# EAGLE design Grove - Tricks v1.0 (EAGLE 7.1.0)

## Sheet 1 of 6
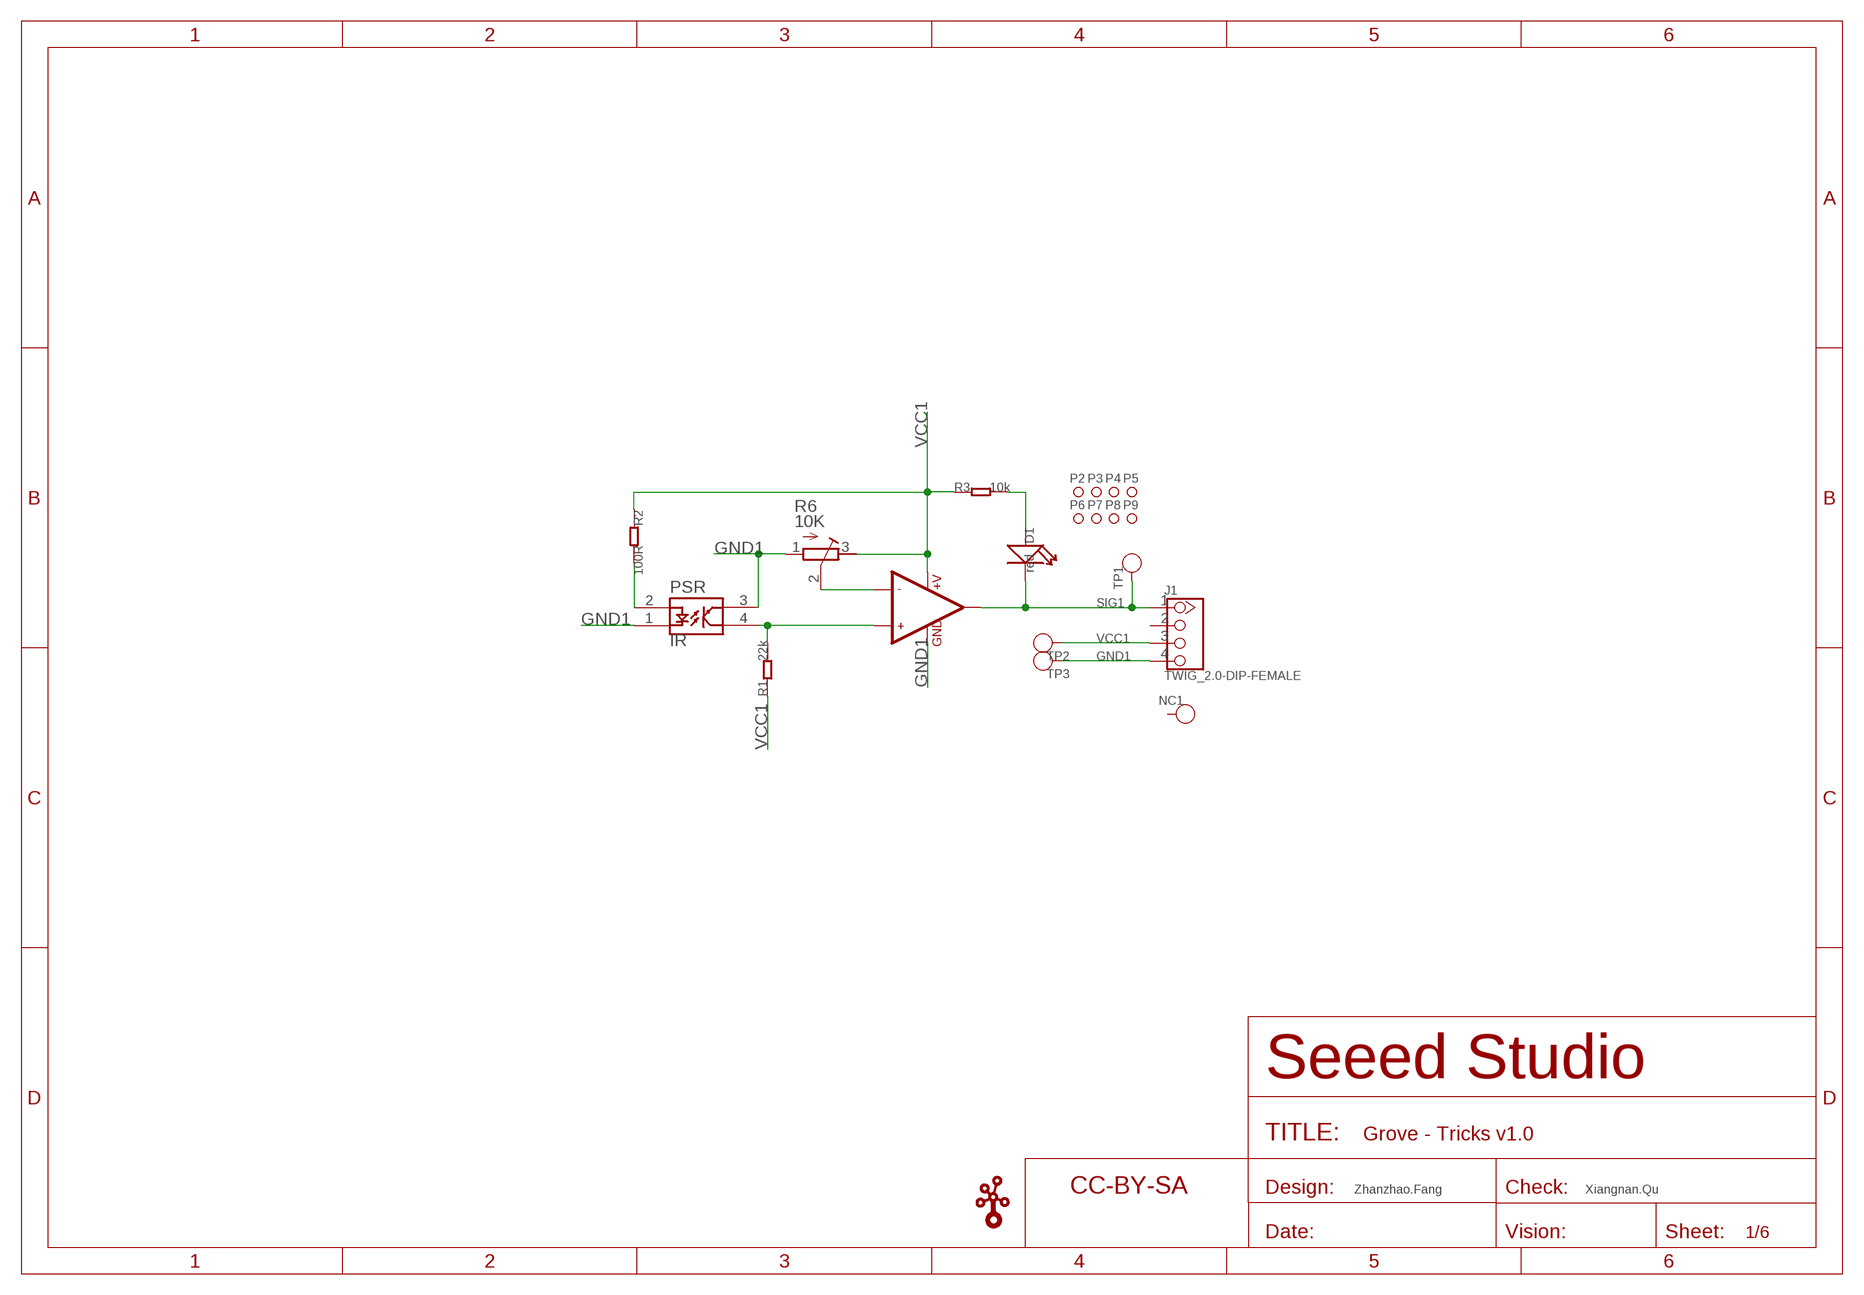
[diagram p0: schematic, sheet 1]

### Parts
D1  red  007-LED35*40  [LED0603]
J1  TWIG_2.0-DIP-FEMALE  [2.0_1X4]
NC1  TEST-POINT'4545'  [TP-D45MIL]
P2  MARK-1.0'ANNULAR'  [ROUND-MARK-1.0]
P3  MARK-1.0'ANNULAR'  [ROUND-MARK-1.0]
P4  MARK-1.0'ANNULAR'  [ROUND-MARK-1.0]
P5  MARK-1.0'ANNULAR'  [ROUND-MARK-1.0]
P6  MARK-1.0'ANNULAR'  [ROUND-MARK-1.0]
P7  MARK-1.0'ANNULAR'  [ROUND-MARK-1.0]
P8  MARK-1.0'ANNULAR'  [ROUND-MARK-1.0]
P9  MARK-1.0'ANNULAR'  [ROUND-MARK-1.0]
PSR  PSR  [PSR]
R1  22k  005-R0603_S  [0603_S]
R2  100R  005-R0603_S  [0603_S]
R3  10k  005-R0603_S  [0603_S]
R6  10K  R-TRIMM3214W  [RTRIM3214W]
TP1  TEST-POINT'4545'  [TP-D45MIL]
TP2  TEST-POINT'4545'  [TP-D45MIL]
TP3  TEST-POINT'4545'  [TP-D45MIL]
U1  002-LMV358  [SO08]
U$2  TWIGLOGOTWIGLOGO_SMALL  [TWIGLOGO_SMALL]
U$3  SEEEDSTUDIO-OPEN-SCH-FRAME  [SEEEDSTUDIO-PCB-FRAME]

### Nets
GND1: J1.4 PSR.1 PSR.3 R6.1(E) TP3.T U1.4(GND)
N$1: R6.2(S) U1.2(-IN1)
N$2: PSR.4 R1.2 U1.3(+IN1)
N$5: PSR.2 R2.2
N$12: D1.1(+) R3.2
SIG1: D1.2(-) J1.1 TP1.T U1.1(OUT1)
VCC1: J1.3 R1.1 R2.1 R3.1 R6.3(A) TP2.T U1.8(+V)
Unconnected: J1.2 NC1.T U1.5(+IN2) U1.6(-IN2) U1.7(OUT2)

### Notes on the sheet
- Zhanzhao.Fang | Xiangnan.Qu

## Sheet 2 of 6
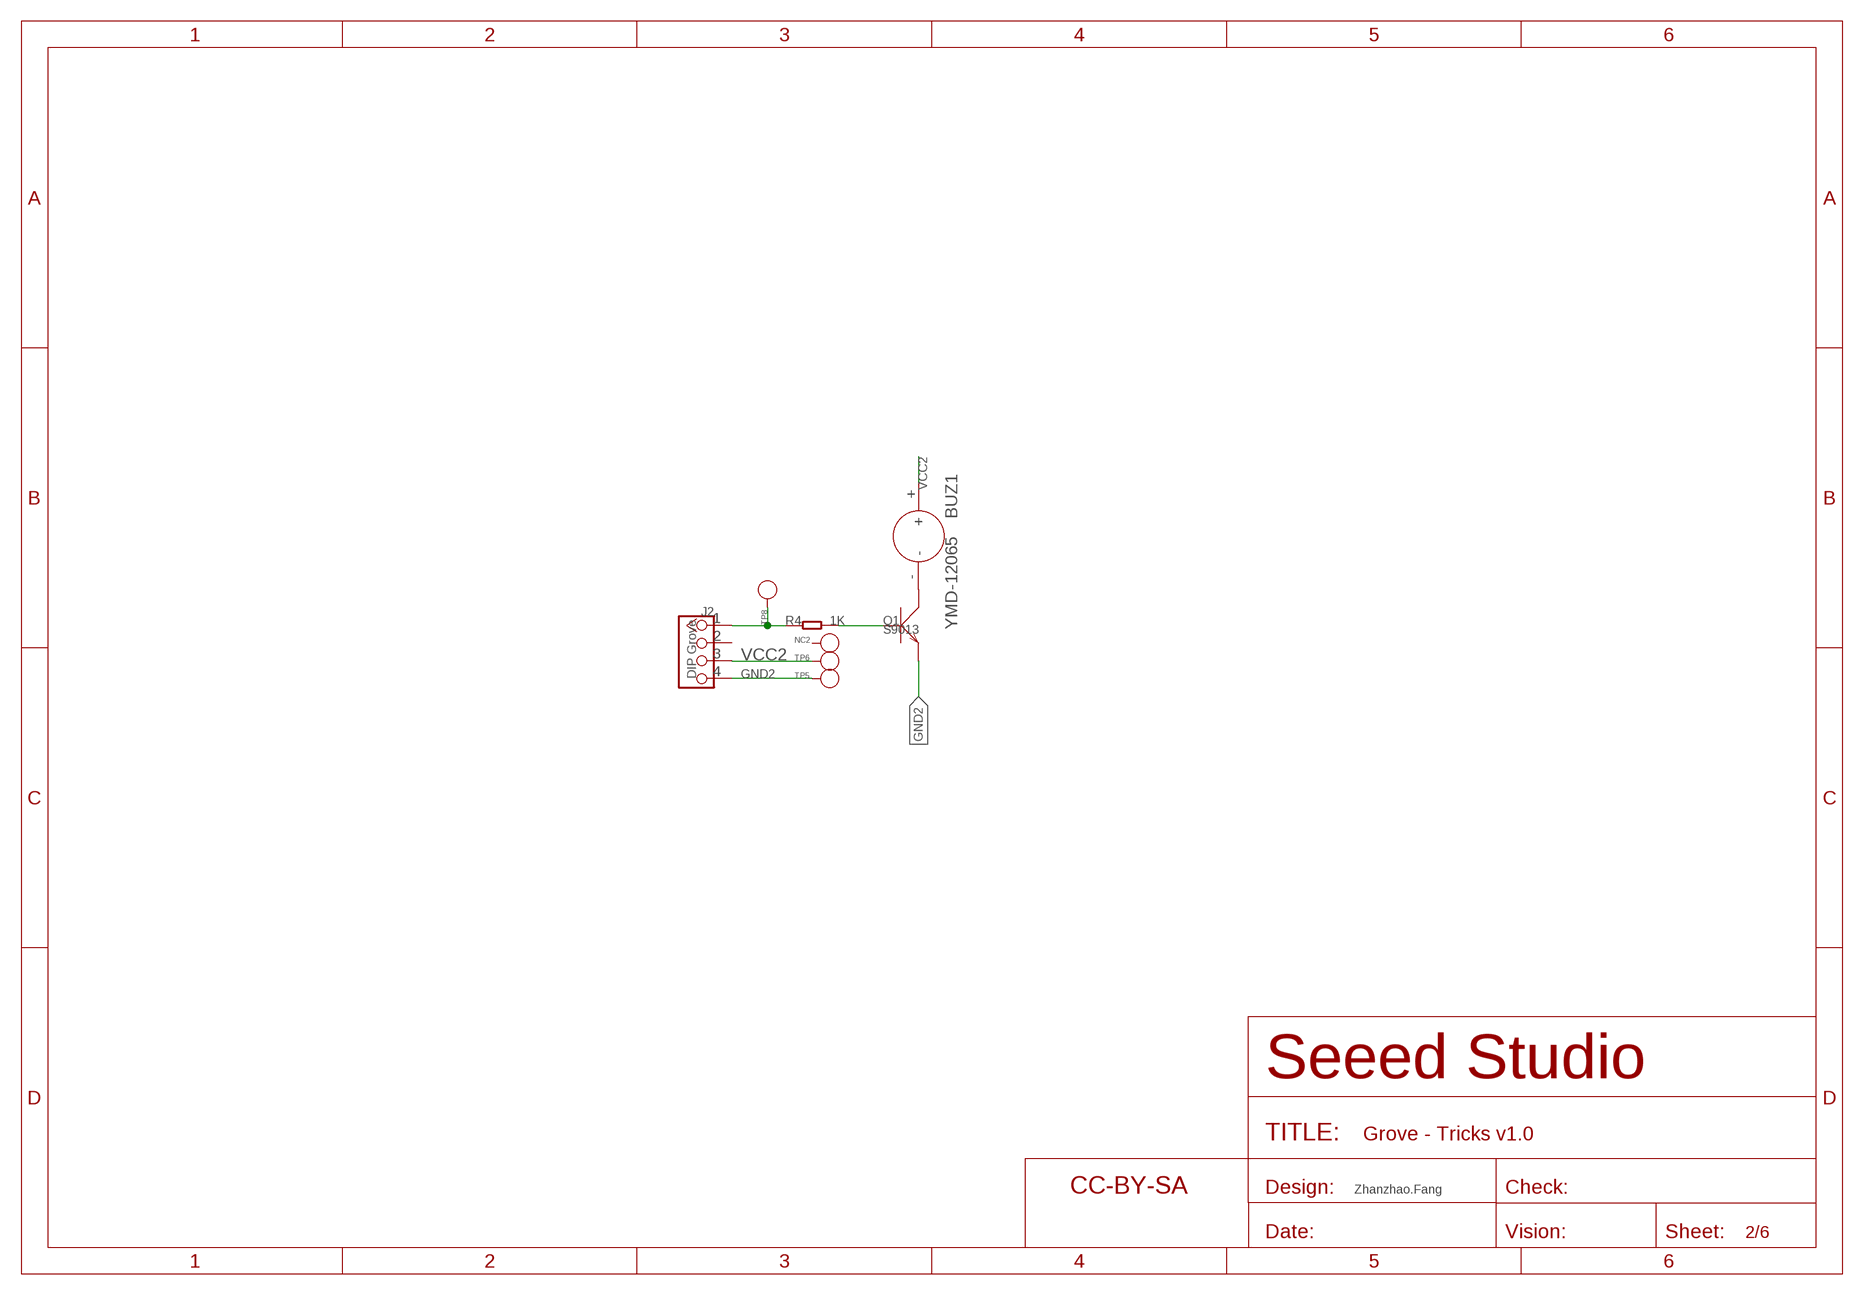
[diagram p1: schematic, sheet 2]

### Parts
BUZ1  YMD-12065  BUZZER-YMD12065  [2P-7.6-D12X6.5H]
J2  DIP Grove  TWIG-4P-2.0-2.0  [4P-2.0]
NC2  PAD-TEST-POINT'4545'  [TP_4545]
Q1  S9013  TRANSISTOR-NPN-SOT23  [SOT23]
R4  1K  R-0603  [R0603]
TP5  PAD-TEST-POINT'4545'  [TP_4545]
TP6  PAD-TEST-POINT'4545'  [TP_4545]
TP8  PAD-TEST-POINT'4545'  [TP_4545]
U$6  SEEEDSTUDIO-OPEN-SCH-FRAME  [SEEEDSTUDIO-PCB-FRAME]

### Nets
GND2: J2.4 Q1.2(E) TP5.T
N$3: Q1.1(B) R4.2
N$4: BUZ1.- Q1.3(C)
N$10: J2.1 R4.1 TP8.T
VCC2: BUZ1.+ J2.3 TP6.T
Unconnected: J2.2 NC2.T

### Notes on the sheet
- Zhanzhao.Fang

## Sheet 3 of 6
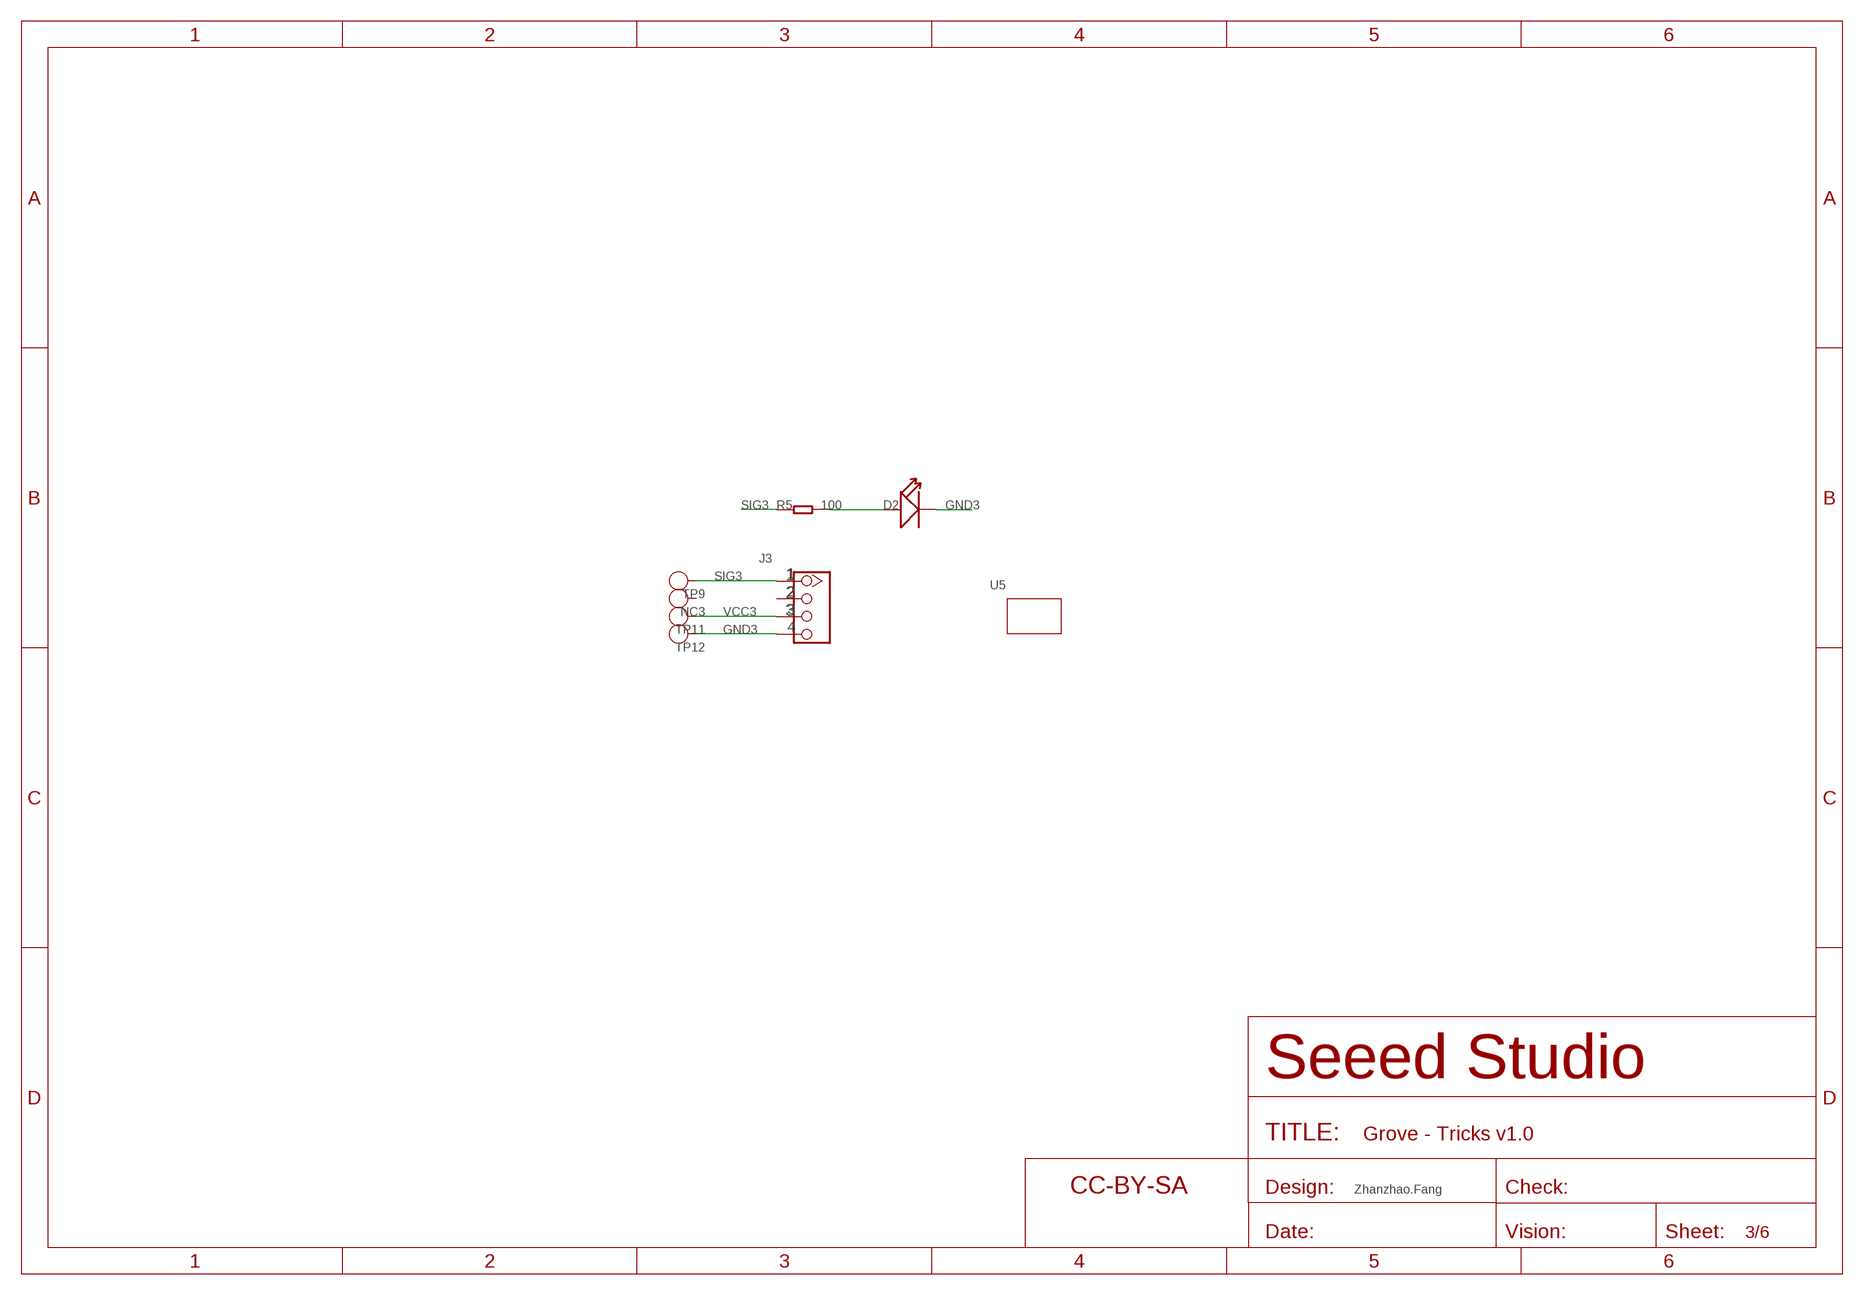
[diagram p2: schematic, sheet 3]

### Parts
D2  LED-3MM  [LED-2P-2.54-3MM]
J3  GROVE-CONNECTOR-DIP-2.0  [HW4-2.0]
NC3  TEST-POINT'4545'  [TP-D45MIL]
R5  100  R-1206  [R1206]
TP9  TEST-POINT'4545'  [TP-D45MIL]
TP11  TEST-POINT'4545'  [TP-D45MIL]
TP12  TEST-POINT'4545'  [TP-D45MIL]
U5  GROVE  [GROVE-1*1-TEST-PLATFORM-LED]
U$4  SEEEDSTUDIO-OPEN-SCH-FRAME  [SEEEDSTUDIO-PCB-FRAME]

### Nets
GND3: D2.K(-) J3.4 TP12.T
N$6: D2.A(+) R5.2
SIG3: J3.1 R5.1 TP9.T
VCC3: J3.3 TP11.T
Unconnected: J3.2 NC3.T

### Notes on the sheet
- 1
- 2
- 3
- Zhanzhao.Fang

## Sheet 4 of 6
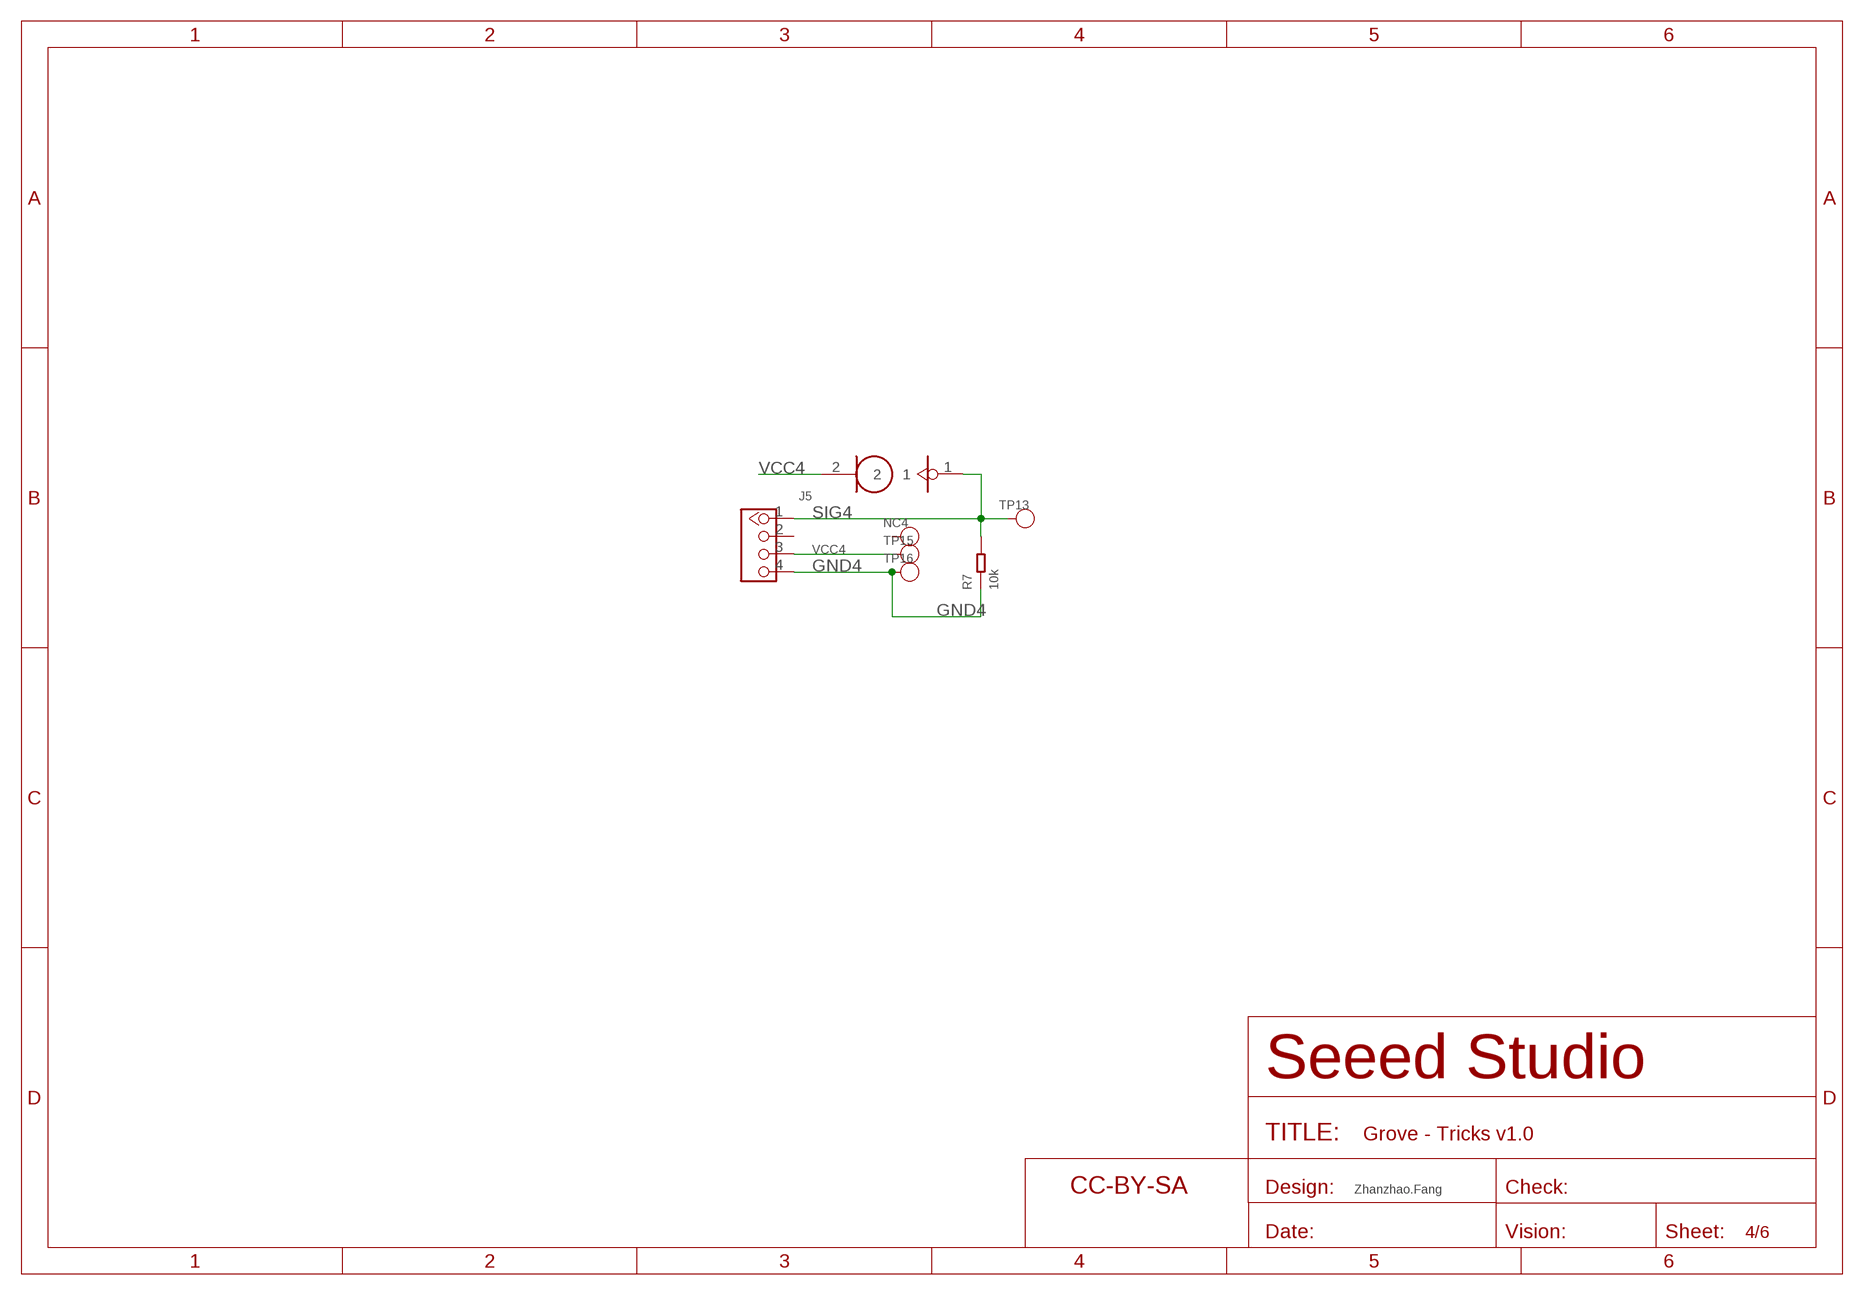
[diagram p3: schematic, sheet 4]

### Parts
J4  TILT  [TILT]
J5  GROVE-CONNECTOR-DIP-2.0  [HW4-2.0]
NC4  TEST-POINT'4545'  [TP-D45MIL]
R7  10k  RES-0603  [R0603]
TP13  TEST-POINT'4545'  [TP-D45MIL]
TP15  TEST-POINT'4545'  [TP-D45MIL]
TP16  TEST-POINT'4545'  [TP-D45MIL]
U$5  SEEEDSTUDIO-OPEN-SCH-FRAME  [SEEEDSTUDIO-PCB-FRAME]

### Nets
GND4: J5.4 R7.1 TP16.T
SIG4: J4.1 J5.1 R7.2 TP13.T
VCC4: J4.2 J5.3 TP15.T
Unconnected: J5.2 NC4.T

### Notes on the sheet
- Zhanzhao.Fang

## Sheet 5 of 6
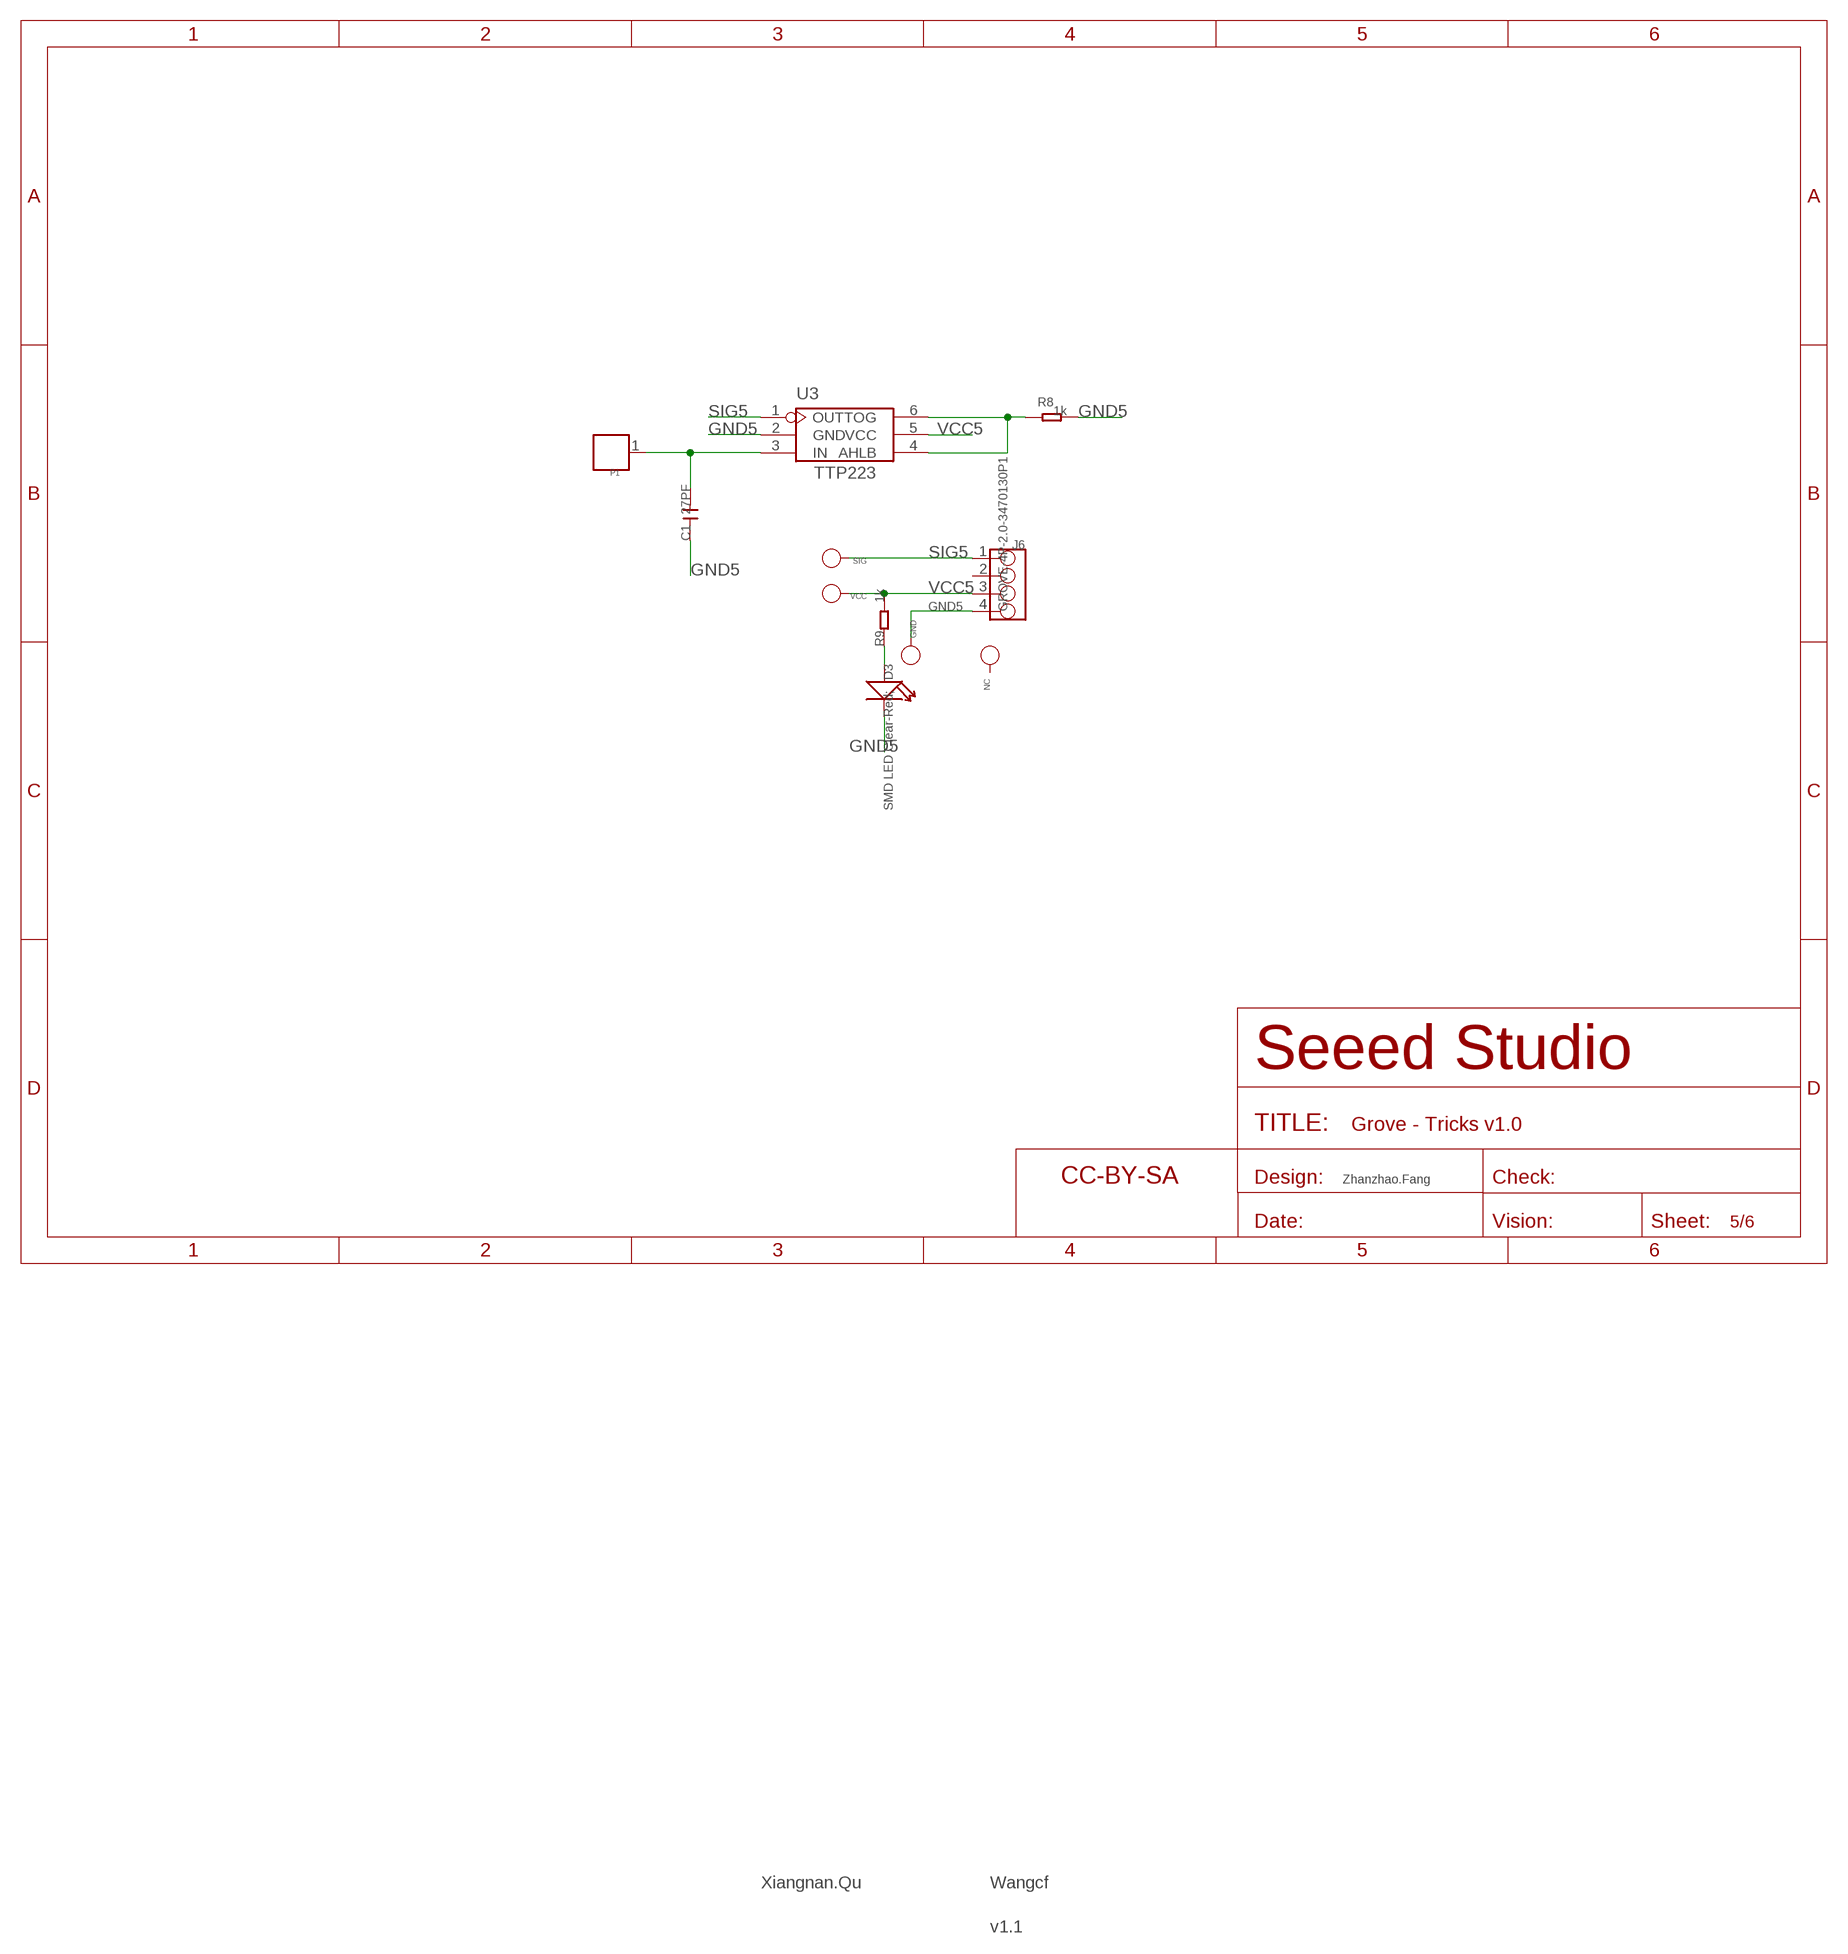
[diagram p4: schematic, sheet 5]

### Parts
C1  27PF  C-0603  [C0603]
D3  SMD LED Clear-Red;  LED'0603'  [LED-0603]
GND  PAD-TEST-POINT'4545'  [TP_4545]
J6  GROVE-4P-2.0-3470130P1  [4P-2.0]
NC  PAD-TEST-POINT'4545'  [TP_4545]
P1  PAD'D450MIL'  [1P-D450]
R8  1k  R-0603  [R0603]
R9  1k  R-0603  [R0603]
SIG  PAD-TEST-POINT'4545'  [TP_4545]
U3  TTP223  [SOT23-6L]
U$12  SEEEDSTUDIO-OPEN-SCH-FRAME  [SEEEDSTUDIO-PCB-FRAME]
VCC  PAD-TEST-POINT'4545'  [TP_4545]

### Nets
GND5: C1.1 D3.- GND.T J6.4 R8.2 U3.2(GND)
IN: C1.2 P1.1 U3.3(IN)
N$7: R8.1 U3.4(AHLB) U3.6(TOG)
N$8: D3.+ R9.1
SIG5: J6.1 SIG.T U3.1(OUT)
VCC5: J6.3 R9.2 U3.5(VCC) VCC.T
Unconnected: J6.2 NC.T

### Notes on the sheet
- TTP223
- Zhanzhao.Fang
- Xiangnan.Qu | Wangcf
- v1.1

## Sheet 6 of 6
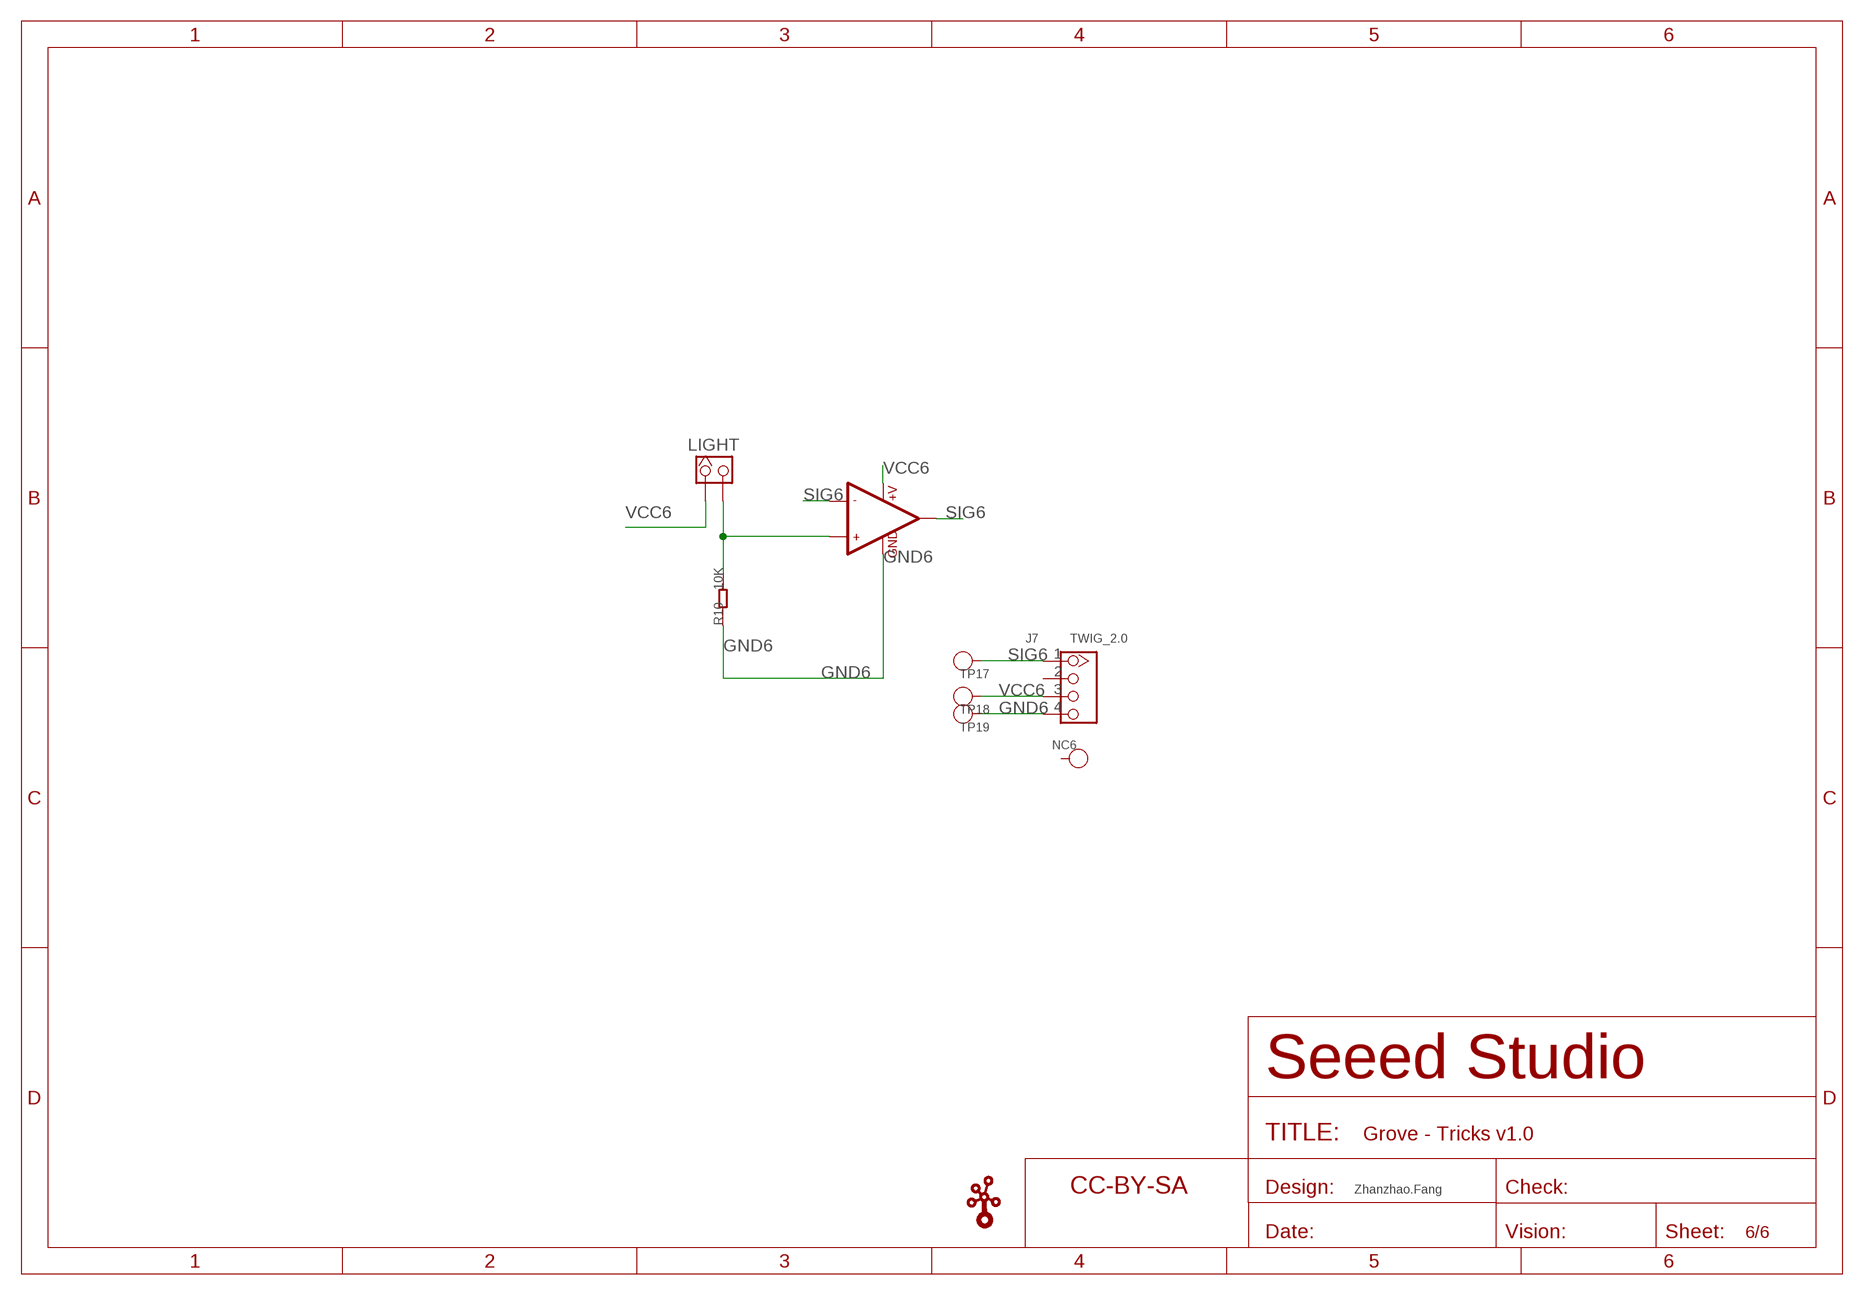
[diagram p5: schematic, sheet 6]

### Parts
J7  TWIG_2.0  GROVE-CONNECTOR-DIP-2.0  [HW4-2.0]
LIGHT  HEADER_1X2_2.54  [CK_1*2]
NC6  TEST-POINT'4545'  [TP-D45MIL]
R10  10K  R0603  [0603]
TP17  TEST-POINT'4545'  [TP-D45MIL]
TP18  TEST-POINT'4545'  [TP-D45MIL]
TP19  TEST-POINT'4545'  [TP-D45MIL]
U4  LMV358  [SO08]
U$13  SEEEDSTUDIO-OPEN-SCH-FRAME  [SEEEDSTUDIO-PCB-FRAME]
U$16  TWIGLOGOTWIGLOGO_SMALL  [TWIGLOGO_SMALL]

### Nets
GND6: J7.4 R10.1 TP19.T U4.4(GND)
N$9: LIGHT.2 R10.2 U4.3(+IN1)
SIG6: J7.1 TP17.T U4.1(OUT1) U4.2(-IN1)
VCC6: J7.3 LIGHT.1 TP18.T U4.8(+V)
Unconnected: J7.2 NC6.T U4.5(+IN2) U4.6(-IN2) U4.7(OUT2)

### Notes on the sheet
- Zhanzhao.Fang

## Library data of the parts
BUZ1 = Discrete:BUZZER
C1 = Discrete:C*: Ceramic Capacitors
D1 = Discrete:007-LED*
D2 D3 = Discrete:LED*
GND NC NC2 SIG TP5 TP6 TP8 VCC = Discrete:PAD-TEST-POINT; PARTNO: DNP
J1 = Connector:TWIG_2.0-DIP-FEMALE
J2 = Connector:TWIG-4P-2.0
J3 J5 J7 = Connector-new:GROVE-CONNECTOR-DIP: 4P-2.0:320110033;4P-2.0-90D:320110034
J4 = Discrete-new:TILT
J6 = OPL:GROVE-4P-2.0
LIGHT = CONNECTER:HEADER_1X2
NC1 NC3 NC4 NC6 TP1-TP3 TP9 TP11-TP13 TP15-TP19 = Discrete-new:TEST-POINT; PARTNO: DNP
P1 = Discrete:PAD
P2-P9 = Discrete-new:MARK-1.0; PARTNO: DNP
PSR = IR:PSR*
Q1 = Discrete:TRANSISTOR-NPN*: NPN audion
R1-R3 = Discrete:005-R*
R4 R5 R8 R9 = Discrete:R*
R6 = rcl:R-TRIMM: Trimm resistor
R7 = Discrete-new:RES
R10 = CPT_SMD:R0603
U1 = ICs:002-LMV358
U3 = Seeed:TTP223
U4 = ICs_v54:LMV358
U5 = moudle-new:GROVE
U$2 U$16 = seeedleo:TWIGLOGO
U$3-U$6 U$12 U$13 = moudle-new:SEEEDSTUDIO-OPEN-SCH-FRAME

## Board
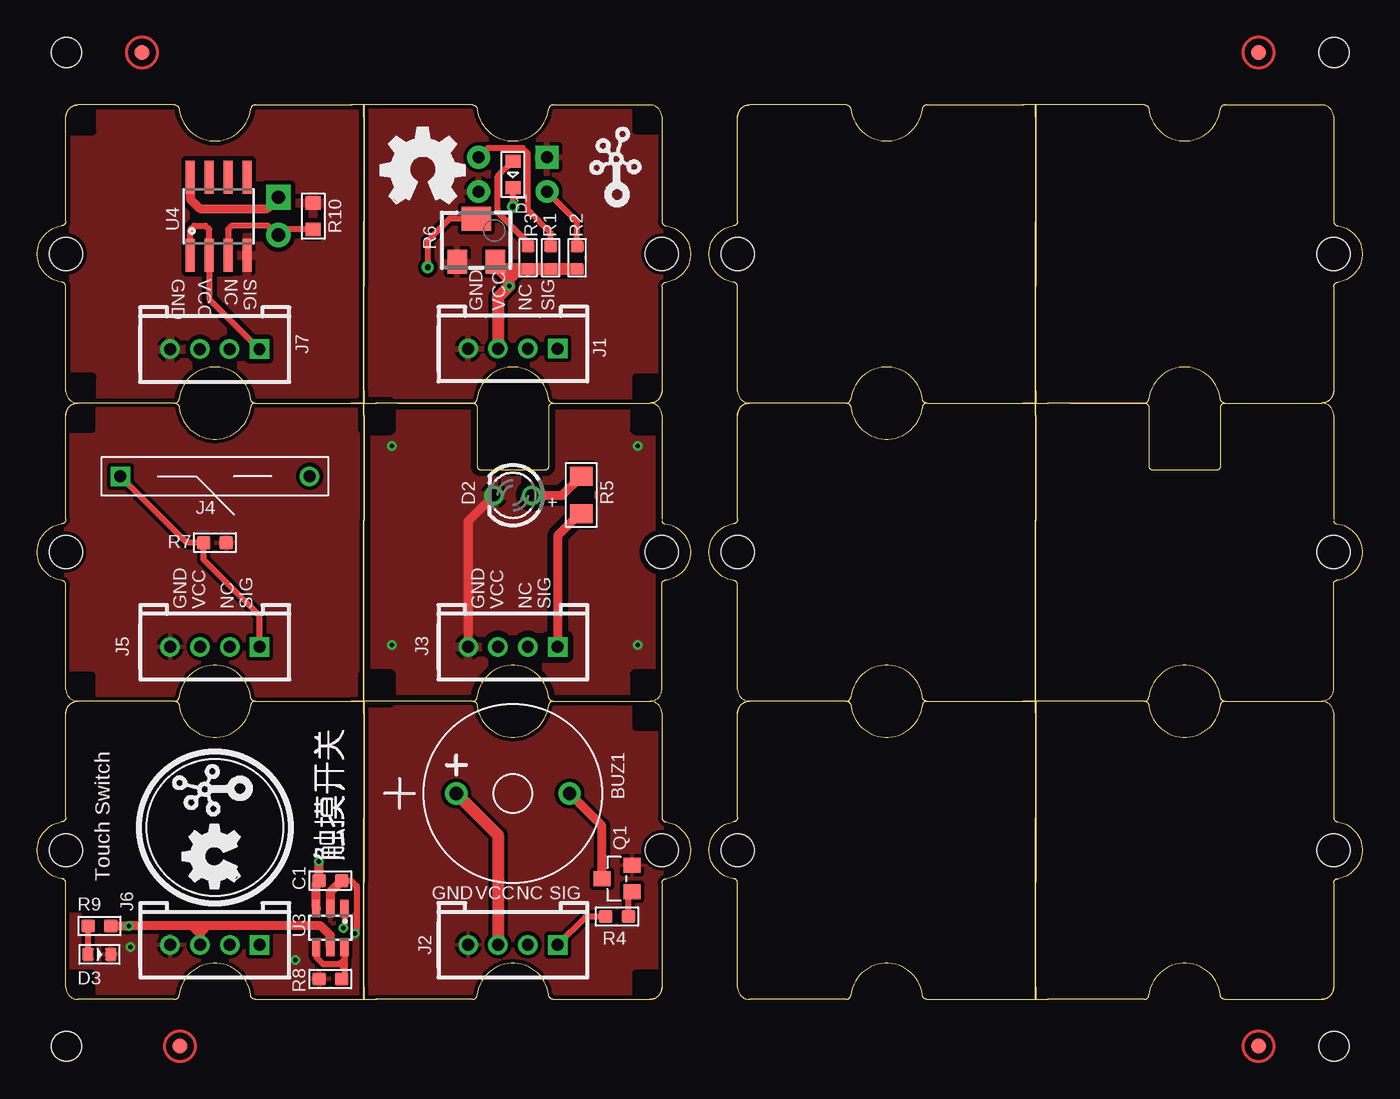
[diagram p6: board, top side]
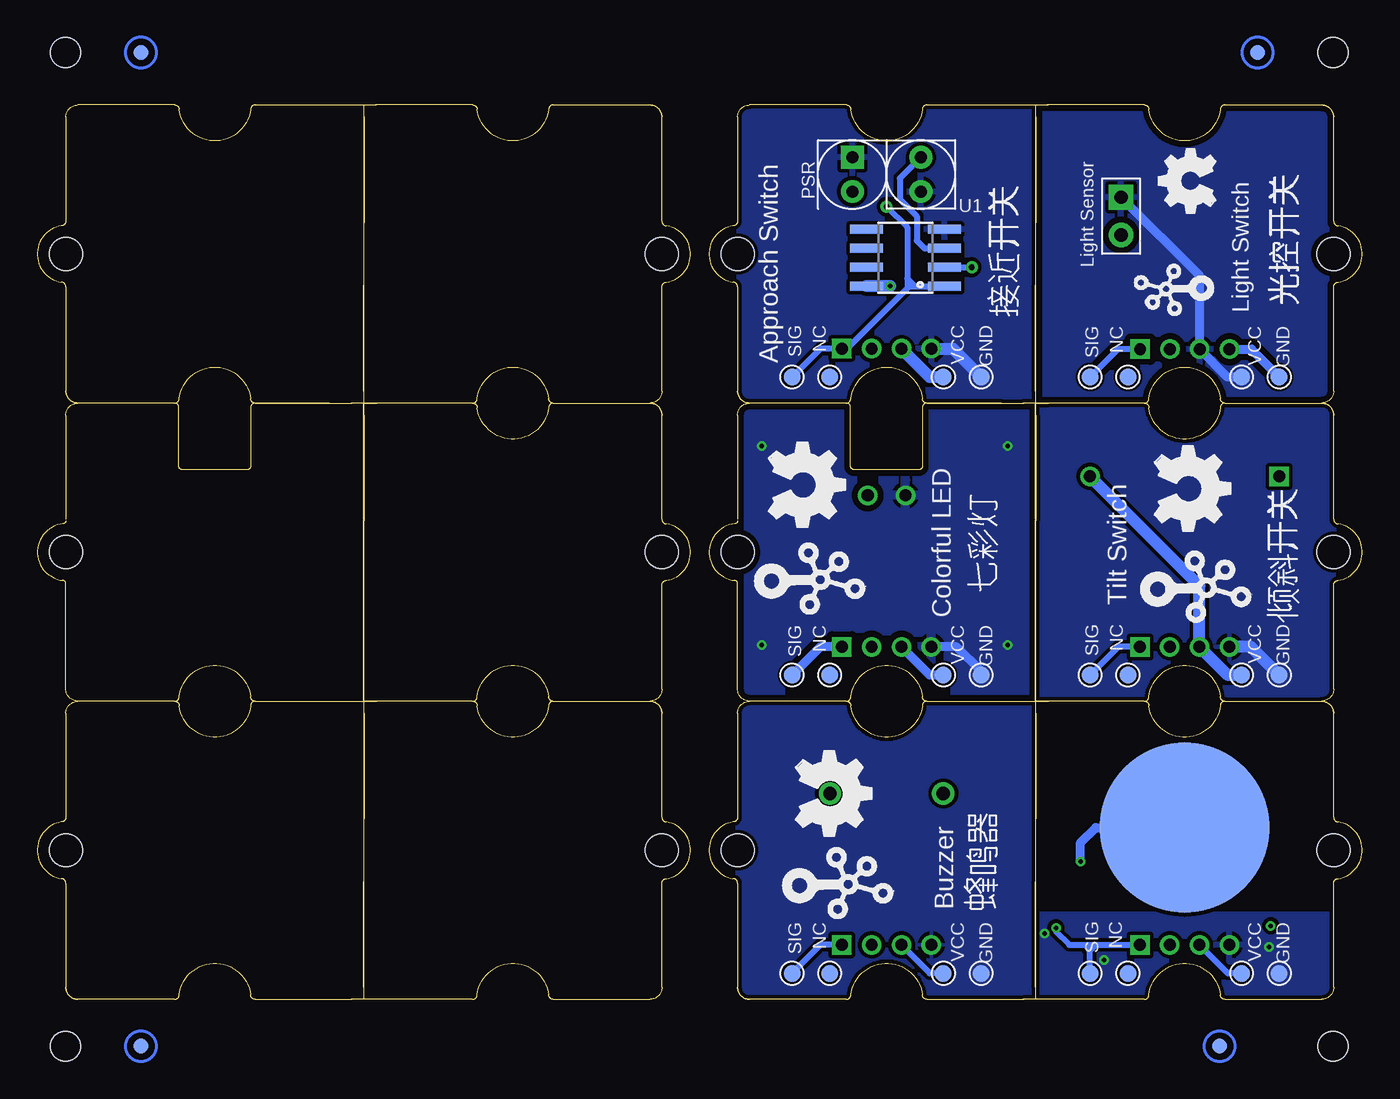
[diagram p7: board, bottom side, seen from below]

Size 88.93 x 60 mm. Coordinates in mm from the lower left corner, seen from the top.
Copper layers (1*16): Top 0.035mm / dielectric 1.5mm / Bottom 0.035mm
Design rules "SeeedStudio_rule_no_angle_090911 *": minimum track width 6mil, minimum drill 12mil, track to track 6mil, track to pad 6mil, pad to pad 6mil, via to via 6mil, smd to smd 0mil, copper to edge 10mil, drill to drill 10mil, minimum pad ring 10mil, minimum via ring 6mil, stop-mask expansion 2mil, vias tented up to drill 100mil, thermal gap 10mil
Holes 2 mm at 1.95,63.53 87.04,63.53 1.95,-3.14 87.04,-3.14

### Footprints (pad centres in the part's own frame; a part is rotated, then mirrored left to right if it is on the bottom)
2P-7.6-D12X6.5H = drill 0.9 pad 1.5: + -3.8,0; - 3.8,0
C0603 = smd 0.889 x 0.889: 1 -0.762,0; 2 0.762,0
LED0603 = smd 0.889 x 1.016: 1 -0.889,0; 2 0.889,0
LED-2P-2.54-3MM = drill 0.813: A -1.27,0; K 1.27,0
LED-0603 = smd 0.762 x 0.889: + -0.762,0; - 0.762,0
TP_4545 = smd 1.143 x 1.143: T 0,0
2.0_1X4 = drill 0.8 pad 1.27 square: 1 -3,0 | drill 0.8 pad 1.27: 2 -1,0; 3 1,0; 4 3,0
4P-2.0 = drill 0.8 pad 1.27 square: 1 -3,0 | drill 0.8 pad 1.27: 2 -1,0; 3 1,0; 4 3,0
HW4-2.0 = drill 0.8 pad 1.27 square: 1 -3,0 | drill 0.8 pad 1.27: 2 -1,0; 3 1,0; 4 3,0
TILT = drill 0.8 square: 1 0,0 | drill 0.8: 2 0,-12.7
CK_1*2 = drill 0.889 pad 1.651 square: 1 0,1.27 | drill 0.889 pad 1.651: 2 0,-1.27
TP-D45MIL = smd 1.143 x 1.143: T 0,0
1P-D450 = smd 11.43 x 11.43: 1 0,0
ROUND-MARK-1.0 = smd 1.016 x 1.016: P$1 0,0
PSR = drill 0.813 pad 1.524 square: 1 -2.3,1.15 | drill 0.813 pad 1.524: 2 -2.3,-1.15; 3 2.3,-1.15; 4 2.3,1.15
SOT23 = smd 1.016 x 1.143: 1 -0.889,-1.016; 2 0.889,-1.016; 3 0,1.016
0603_S = smd 0.762 x 0.889: 1 -0.762,0; 2 0.762,0
R0603 = smd 0.889 x 0.889: 1 -0.762,0; 2 0.762,0
R1206 = smd 1.27 x 1.524: 1 -1.27,0; 2 1.27,0
RTRIM3214W = smd 1.3 x 1.6: 1 -1.275,-1.45; 3 1.275,-1.45 | smd 2 x 1.6: 2 0,1.45
R0603' = smd 0.889 x 0.889: 1 0,0.762; 2 0,-0.762
0603 = smd 0.889 x 1.016: 1 -0.889,0; 2 0.889,0
GROVE-1*1-TEST-PLATFORM@1 = hole 2.2: -10,0
SO08 = smd 0.61 x 2.21: 1 -1.905,-2.616; 2 -0.635,-2.616; 3 0.635,-2.616; 4 1.905,-2.616; 5 1.905,2.616; 6 0.635,2.616; 7 -0.635,2.616; 8 -1.905,2.616
GROVE-1*1-TEST-PLATFORM-LED = hole 2.2: 0,-10
SOT23-6L = smd 0.55 x 1.2: 1 -0.95,-1.3; 2 0,-1.3; 3 0.95,-1.3; 4 0.95,1.3; 5 0,1.3; 6 -0.95,1.3

### Placement (x,y rotation side)
BUZ1  31.92,13.81 0 top
C1  19.67,7.97 180 top
D1  31.92,55.34 270 top
D2  31.92,33.81 180 top
D3  4.17,3.02 0 top
GND  5.57,1.75 270 bottom
J1  31.92,43.66 180 top
J2  31.92,3.65 180 top
J3  31.92,23.65 180 top
J4  5.57,35.08 90 top
J5  11.92,23.65 180 top
J6  11.92,3.65 180 top
J7  11.91,43.62 180 top
LIGHT  16.19,52.55 0 bottom
NC  15.73,1.75 270 bottom
NC1  35.73,41.75 270 bottom
NC2  35.73,1.75 270 bottom
NC3  35.73,21.75 90 bottom
NC4  15.73,21.75 0 bottom
NC6  15.73,41.75 90 bottom
P1  11.92,11.52 270 bottom
P2  9.57,-3.14 90 top  (outside the outline)
P3  9.57,-3.14 270 bottom  (outside the outline)
P4  81.96,-3.14 90 top  (outside the outline)
P5  81.96,-3.14 270 bottom  (outside the outline)
P6  7.03,63.53 90 top  (outside the outline)
P7  7.03,63.53 270 bottom  (outside the outline)
P8  81.96,63.53 90 top  (outside the outline)
P9  81.96,63.53 270 bottom  (outside the outline)
PSR  31.92,55.34 0 bottom
Q1  38.91,8.1 90 top
R1  34.46,49.75 90 top
R2  36.24,49.75 90 top
R3  32.94,49.75 90 top
R4  38.91,5.56 0 top
R5  36.52,33.84 90 top
R6  29.46,50.93 0 top
R7  10k  [R0603']  11.92,30.64 270 top
R8  19.67,1.36 180 top
R9  4.17,4.92 0 top
R10  18.53,52.55 270 top
SIG  18.27,1.75 270 bottom
TP1  38.27,41.75 270 bottom
TP2  28.11,41.75 270 bottom
TP3  25.57,41.75 270 bottom
TP5  25.57,1.75 270 bottom
TP6  28.11,1.75 270 bottom
TP8  38.27,1.75 270 bottom
TP9  38.27,21.75 90 bottom
TP11  28.11,21.75 90 bottom
TP12  25.57,21.75 90 bottom
TP13  18.27,21.75 0 bottom
TP15  8.11,21.75 0 bottom
TP16  5.57,21.75 0 bottom
TP17  18.27,41.75 90 bottom
TP18  8.11,41.75 90 bottom
TP19  5.57,41.75 90 bottom
TWIG1  [GROVE-1*1-TEST-PLATFORM@1]  31.92,10 180 top
TWIG2  [GROVE-1*1-TEST-PLATFORM@1]  31.92,50 180 top
TWIG3  [GROVE-1*1-TEST-PLATFORM@1]  11.92,10 0 top
TWIG4  [GROVE-1*1-TEST-PLATFORM@1]  57.01,50 0 top
TWIG5  [GROVE-1*1-TEST-PLATFORM@1]  57.01,30 0 top
TWIG6  [GROVE-1*1-TEST-PLATFORM@1]  77.01,50 180 top
TWIG7  [GROVE-1*1-TEST-PLATFORM@1]  11.92,50 0 top
TWIG8  [GROVE-1*1-TEST-PLATFORM@1]  11.92,30 0 top
TWIG9  [GROVE-1*1-TEST-PLATFORM@1]  57.01,10 0 top
TWIG10  [GROVE-1*1-TEST-PLATFORM@1]  77.01,10 180 top
U1  30.65,49.75 90 bottom
U2  [GROVE-1*1-TEST-PLATFORM-LED]  77.01,30 90 top
U3  19.67,4.79 180 top
U4  12.18,52.55 0 top
U5  31.92,30 90 top
U$1  [OSHW_FILLX200_NOTEXT]  23.03,53.4 0 top
U$2  36.67,53.01 0 top
U$3  -3.89,-19.27 0 top  (outside the outline)
U$4  -4.4,-25.88 0 top  (outside the outline)
U$5  -4.91,-32.48 0 top  (outside the outline)
U$6  -6.43,-52.29 0 top  (outside the outline)
U$7  [OSHW_FILLX200_NOTEXT]  38.01,16.64 270 bottom
U$8  [TWIGLOGO]  37.97,7.69 270 bottom
U$9  [TWIGLOGO]  39.85,28.12 270 bottom
U$10  [OSHW_FILLX200_NOTEXT]  39.81,37.36 270 bottom
U$11  [OSHW_FILLX200_NOTEXT]  13.93,37.1 270 bottom
U$12  -6.94,-58.9 0 top  (outside the outline)
U$13  -5.41,-39.09 0 top  (outside the outline)
U$14  [OSHW_FILLX150_NOTEXT]  13.57,7.46 90 top
U$15  [TWIGLOGO_SMALL]  14.59,11.91 90 top
U$16  9.81,45.47 90 bottom
U$17  [OSHW_FILLX150_NOTEXT]  9.85,52.79 90 bottom
U$18  [TWIGLOGO]  13.93,27.58 270 bottom
VCC  8.11,1.75 270 bottom

### Tracks (layer width: path | path; a pad name or v marks a point on that pad's centre or on a via)
GND1
  Bottom 0.813: J1.4 27.48,43.66 TP3.T
  pour Top (isolate 0.254): 21.89,59.91 21.89,39.97 41.96,40.1 41.96,59.91
  pour Bottom (isolate 0.254): 21.89,59.78 21.89,39.97 41.96,40.1 41.96,59.91
GND2
  pour Bottom (isolate 0.254): 41.96,-0.16 41.96,20.16 21.89,20.16 21.89,-0.16
  pour Top (isolate 0.254): 41.96,-0.16 41.96,20.16 21.89,20.16 21.89,-0.16
GND3  (via drill 0.3 pad 0.64)
  Top 0.61: D2.K 28.92,32.08 J3.4
  Bottom 0.61: TP12.T 25.57,22 27.22,23.65 J3.4
  other vias: 23.8,23.78 23.8,37.11 40.31,37.11 40.31,23.78
  pour Bottom (isolate 0.406): 21.76,40.16 41.96,40.16 arc-90 41.96,40.04 41.96,19.97 21.89,19.84 arc-90 21.76,20.1
  pour Top (isolate 0.406): 21.76,40.16 41.96,40.16 arc-90 41.96,39.91 41.96,19.84 22.02,19.84 arc-90 21.76,20.1
GND4
  Bottom 0.813: TP16.T 7.48,23.65 J5.4
  pour Top (isolate 0.254): 1.89,40.04 21.95,40.04 22.08,19.97 2.02,19.97
  pour Bottom (isolate 0.254): 1.76,40.04 21.83,40.04 22.08,19.97 2.02,19.97
GND5  (via drill 0.3 pad 0.64)
  Top 0.406: C1.1 21.07,7.97 21.45,7.59 21.45,4.67
  Top 0.61: C1.1 19.67,7.21 U3.2
  other vias: 6.27,3.52 17.32,2.63 21.32,4.41
  pour Bottom (isolate 0.254): 1.89,-0.03 1.89,5.68 21.95,5.68 21.95,-0.03
  pour Top (isolate 0.254): 1.89,-0.03 1.89,5.68 21.95,5.68 21.95,-0.03
GND6
  Bottom 0.61: J7.4 7.44,43.62 TP19.T
  pour Top (isolate 0.305): 1.89,40.1 1.89,60.16 21.95,60.04 21.83,40.1
IN  (via drill 0.3 pad 0.64)
  Top 0.61: U3.3 18.72,7.78 C1.2 v18.91,9.24
  Bottom 0.61: P1.1 17.89,11.52 18.91,10.51 v18.91,9.24
N$1  (via drill 0.38 pad 0.81)
  Top 0.406: R6.2 27.69,52.38 26.21,50.89 v26.21,49.12
  Bottom 0.406: U1.2 v26.21,49.12
N$2
  Top 0.406: R1.2 34.46,51.4 32.94,52.93 32.94,56.76 32.59,57.11 30.24,57.11 PSR.4
  Bottom 0.406: U1.3 29.38,50.39 29.89,50.89 29.89,52.55 31.04,53.69 31.04,55.07 PSR.4
N$3
  Top 0.406: R4.2 39.67,6.95 Q1.1
N$4
  Top 0.61: Q1.3 37.89,11.64 BUZ1.-
N$5
  Top 0.406: R2.2 36.24,52.17 PSR.2
N$6
  Top 0.61: D2.A 35.23,33.81 R5.2
N$7
  Top 0.406: U3.6 20.62,2.38 | 20.62,2.38 20.62,1.55 R8.1 | U3.4 18.72,2.82 19.16,2.38 20.3,2.38 | 20.3,2.38 20.62,2.38 | 20.3,2.38 20.56,2.13 | 20.3,2.38 20.56,2.63
N$8
  Top 0.406: D3.+ R9.1
N$9
  Top 0.406: R10.2 16.75,51.66 16.37,51.27 LIGHT.2 16.11,51.27 15.48,51.91 13.06,51.91 12.81,51.66 U4.3
N$10
  Top 0.406: R4.1 36.83,5.56 J2.1
  Bottom 0.406: J2.1 36.37,3.65 TP8.T
N$12
  Top 0.406: R3.2 32.94,50.77 30.91,52.8 30.91,55.21 D1.1
SIG1  (via drill 0.38 pad 0.81)
  Top 0.406: v31.92,53.18 D1.2
  Bottom 0.406: 30.53,47.72 34.59,43.66 J1.1 36.37,43.66 TP1.T | 30.53,47.72 30.4,47.85 30.02,47.85 | 30.02,47.85 U1.1 | v31.92,53.18 30.53,51.78 30.53,48.35 | 30.53,48.35 30.53,47.72 | 30.02,47.85 30.53,48.35
SIG3
  Top 0.61: R5.1 36.39,32.57 34.92,31.1 J3.1
  Bottom 0.61: J3.1 36.37,23.65 TP9.T
SIG4
  Top 0.406: J5.1 14.92,25.73 11.16,29.49 R7.2 10.02,30.64 J4.1
  Bottom 0.406: J5.1 16.37,23.65 TP13.T
SIG5  (via drill 0.3 pad 0.64)
  Top 0.406: U3.1 20.62,4.85 v20.56,4.79
  Bottom 0.406: v20.56,4.79 20.56,4.54 19.67,3.65 18.65,3.65 | 18.65,3.65 18.14,3.65 | 18.14,3.65 17.89,3.65 | 18.27,3.27 18.27,3.52 18.14,3.65 | 18.27,3.27 17.89,3.65 | 18.27,3.27 18.65,3.65 | 17.89,3.65 J6.1 | SIG.T 18.27,3.27
SIG6
  Top 0.406: U4.1 10.27,51.66 10.52,51.91 11.29,51.91 11.54,51.66 U4.2 11.54,46.99 J7.1
  Bottom 0.406: J7.1 16.4,43.62 TP17.T
VCC1  (via drill 0.3 pad 0.64)
  Top 0.813: 32.92,48.97 R3.1 | R3.1 32.3,48.99 | 32.3,48.99 31.67,48.99 | 31.67,48.99 31.23,48.99 R6.3 | 31.67,48.35 v31.67,47.85 30.92,47.1 J1.3 | 31.67,48.35 31.67,48.99 | 31.67,48.35 31.03,48.99 | 31.67,48.35 32.3,48.99 | R2.1 R1.1 R3.1
  Bottom 0.813: TP2.T 29.02,41.75 J1.3 | v31.67,47.85 U1.8
VCC2
  Top 0.813: BUZ1.+ 30.92,11.01 J2.3
  Bottom 0.406: TP6.T 29.02,1.75 J2.3
VCC3
  Bottom 0.61: TP11.T 29.02,21.75 J3.3
VCC4
  Bottom 0.813: J4.2 10.92,27.73 J5.3 9.02,21.75 TP15.T
VCC5  (via drill 0.3 pad 0.64)
  Top 0.61: U3.5 19.67,4.28 19.03,4.92 11.41,4.92 | 11.41,4.92 10.91,4.92 | 10.91,4.92 10.4,4.92 | 10.92,4.47 10.92,4.9 10.91,4.92 | 10.92,4.47 10.85,4.47 10.4,4.92 | 10.92,4.47 10.96,4.47 11.41,4.92 | 10.4,4.92 v6.14,4.92 R9.2 | 10.92,4.47 J6.3
  Bottom 0.406: VCC.T 9.02,1.75 J6.3
VCC6
  Top 0.61: U4.8 10.27,53.69 10.91,53.05 15.43,53.05 LIGHT.1
  Bottom 0.61: TP18.T 9.04,41.75 J7.3 10.91,48.54 LIGHT.1
  pour Bottom (isolate 0.406): 1.89,40.1 1.89,60.16 21.95,60.04 21.95,40.1

### Text on the board
tPlace: GND | VCC | NC | SIG | GND | VCC | NC | SIG | + | GND | VCC | NC | SIG | GND | VCC | NC | SIG | Touch Switch | GND | VCC | NC | SIG
bPlace: Light Sensor | Light Switch | GND | VCC | NC | SIG | GND | VCC | NC | SIG | Approach Switch | Tilt Switch | Colorful LED | GND | VCC | NC | SIG | GND | VCC | NC | SIG | Buzzer | GND | VCC | NC | SIG